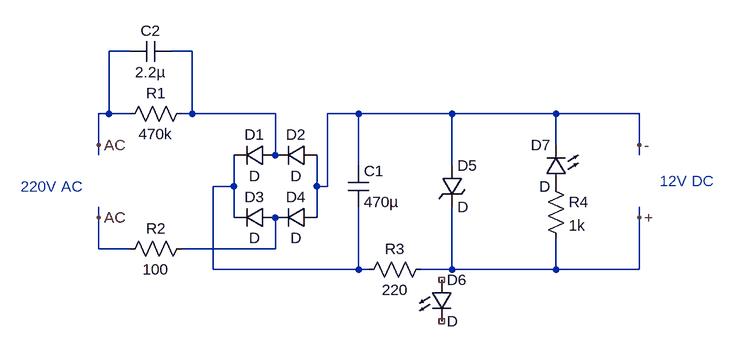
[diagram p0: schematic Draft1.asc]
Draft1.asc, the LTspice schematic file:
Version 4
SHEET 1 888 680
WIRE -16 -48 -48 -48
WIRE 80 -48 48 -48
WIRE -48 48 -48 -48
WIRE -48 48 -64 48
WIRE -16 48 -48 48
WIRE 80 48 80 -48
WIRE 80 48 64 48
WIRE 208 48 80 48
WIRE 336 48 288 48
WIRE 480 48 336 48
WIRE 640 48 480 48
WIRE 768 48 640 48
WIRE -64 96 -64 48
WIRE 640 96 640 48
WIRE 768 96 768 48
WIRE -64 112 -64 96
WIRE 208 112 208 48
WIRE 768 112 768 96
WIRE 336 128 336 48
WIRE 480 128 480 48
WIRE 144 160 144 112
WIRE 144 160 112 160
WIRE 272 160 272 112
WIRE 288 160 288 48
WIRE 288 160 272 160
WIRE -64 208 -64 192
WIRE 144 208 144 160
WIRE 272 208 272 160
WIRE 768 208 768 192
WIRE -64 256 -64 208
WIRE -16 256 -64 256
WIRE 208 256 208 208
WIRE 208 256 64 256
WIRE 112 288 112 160
WIRE 336 288 336 192
WIRE 336 288 112 288
WIRE 352 288 336 288
WIRE 480 288 480 192
WIRE 480 288 432 288
WIRE 640 288 640 240
WIRE 640 288 480 288
WIRE 768 288 768 208
WIRE 768 288 640 288
FLAG 768 208 +
FLAG 768 96 -
FLAG -64 96 AC
FLAG -64 208 AC
SYMBOL diode 208 96 R90
WINDOW 0 0 32 VBottom 2
WINDOW 3 32 32 VTop 2
SYMATTR InstName D1
SYMBOL diode 272 96 R90
WINDOW 0 0 32 VBottom 2
WINDOW 3 32 32 VTop 2
SYMATTR InstName D2
SYMBOL diode 208 192 R90
WINDOW 0 0 32 VBottom 2
WINDOW 3 32 32 VTop 2
SYMATTR InstName D3
SYMBOL diode 272 192 R90
WINDOW 0 0 32 VBottom 2
WINDOW 3 32 32 VTop 2
SYMATTR InstName D4
SYMBOL res 80 32 R90
WINDOW 0 0 56 VBottom 2
WINDOW 3 32 56 VTop 2
SYMATTR InstName R1
SYMATTR Value 470k
SYMATTR SpiceLine pwr=1
SYMBOL res 80 240 R90
WINDOW 0 0 56 VBottom 2
WINDOW 3 32 56 VTop 2
SYMATTR InstName R2
SYMATTR Value 100
SYMATTR SpiceLine pwr=1
SYMBOL cap -16 -64 M90
WINDOW 0 0 32 VBottom 2
WINDOW 3 32 32 VTop 2
SYMATTR InstName C2
SYMATTR Value 2.2µ
SYMATTR SpiceLine V=400
SYMBOL res 448 272 R90
WINDOW 0 0 56 VBottom 2
WINDOW 3 32 56 VTop 2
SYMATTR InstName R3
SYMATTR Value 220
SYMATTR SpiceLine pwr=1
SYMBOL cap 320 128 R0
SYMATTR InstName C1
SYMATTR Value 470µ
SYMATTR SpiceLine V=100
SYMBOL zener 464 128 R0
SYMATTR InstName D5
SYMBOL LED 448 304 R0
SYMATTR InstName D6
SYMBOL LED 656 160 R180
WINDOW 0 24 64 Left 2
WINDOW 3 24 0 Left 2
SYMATTR InstName D7
SYMBOL res 624 144 R0
SYMATTR InstName R4
SYMATTR Value 1k
SYMATTR SpiceLine pwr=0.25
TEXT -184 160 Left 2 ;220V AC
TEXT 800 152 Left 2 ;12V DC

The netlist it stands for:
* Draft1.asc
D1 N001 N002 D
D2 - N001 D
D3 N003 N002 D
D4 - N003 D
R1 N001 AC 470k pwr=1
R2 N003 AC 100 pwr=1
C2 AC N001 2.2µ V=400
R3 + N002 220 pwr=1
C1 - N002 470µ V=100
D5 - + D
D6 NC_01 NC_02 D
D7 P001 - D
R4 P001 + 1k pwr=0.25
.model D D
.lib standard.dio
* 220V AC
* 12V DC
.backanno
.end